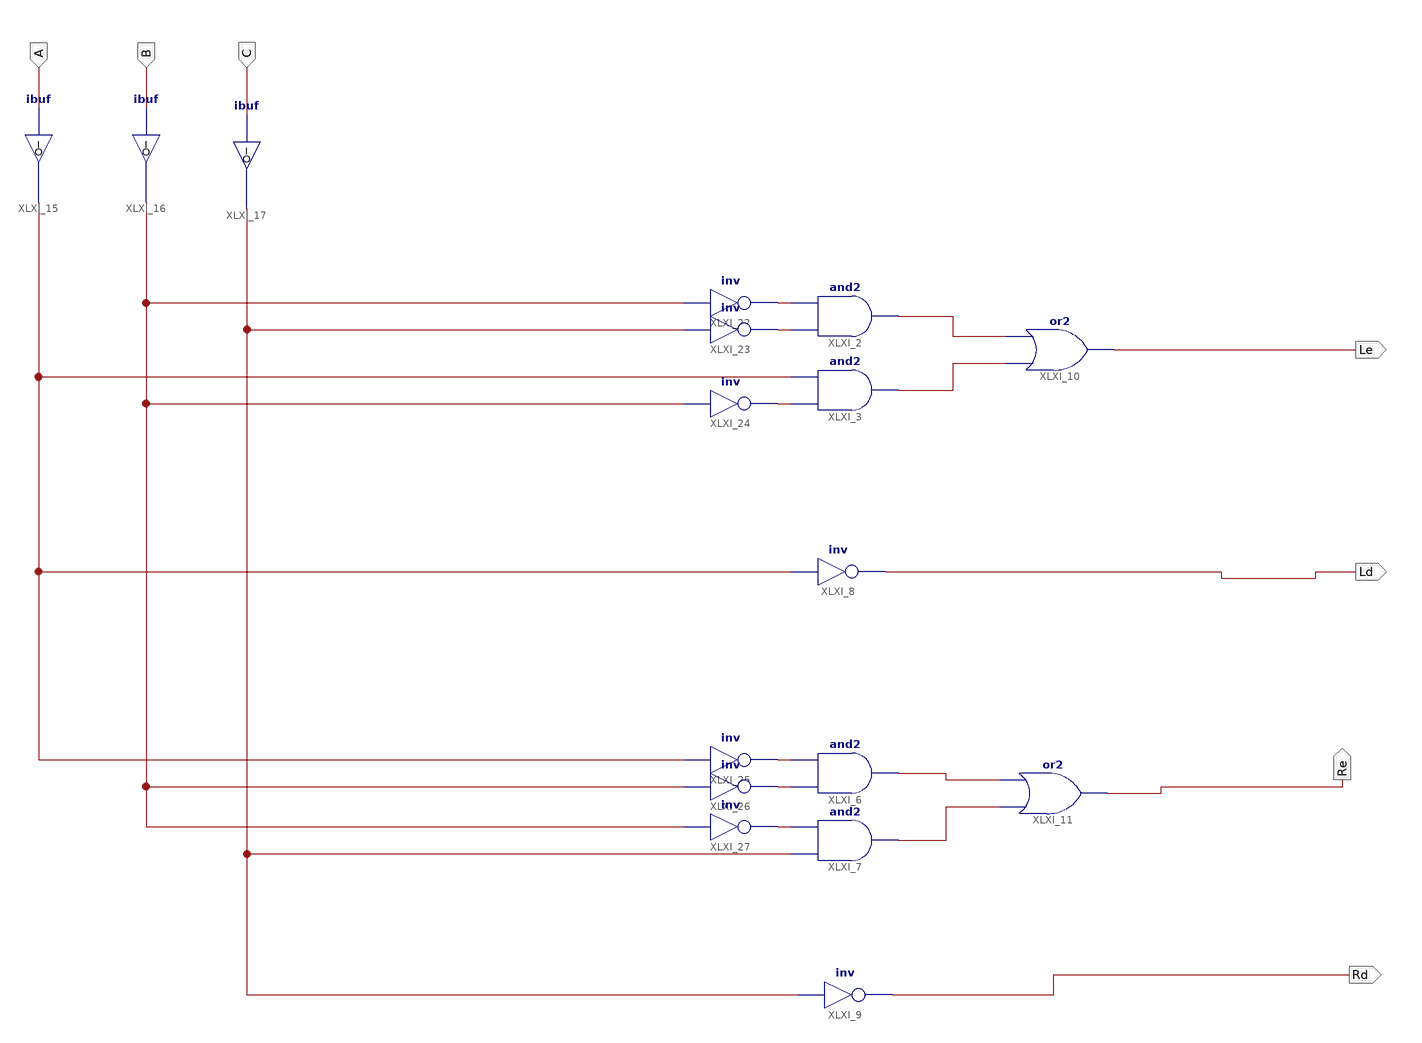
[diagram p0: schematic sheet 1]
// Xilinx ISE schematic Section3_Schematic.sch (xc9500xl) as structural Verilog: 17 symbols, 7 ports
module Section3_Schematic (
  input  A,
  input  B,
  input  C,
  output Le,
  output Ld,
  output Re,
  output Rd
);

  wire XLXN_3, XLXN_4, XLXN_7, XLXN_8, XLXN_11, XLXN_12, XLXN_13, XLXN_14, XLXN_15, XLXN_16, XLXN_17,
       XLXN_20, XLXN_24;

  and XLXI_2 (XLXN_3, XLXN_12, XLXN_11);
  and XLXI_3 (XLXN_4, XLXN_13, XLXN_17);
  and XLXI_6 (XLXN_7, XLXN_15, XLXN_14);
  and XLXI_7 (XLXN_8, XLXN_24, XLXN_16);
  not XLXI_8 (Ld, XLXN_17);
  not XLXI_9 (Rd, XLXN_24);
  or XLXI_10 (Le, XLXN_4, XLXN_3);
  or XLXI_11 (Re, XLXN_8, XLXN_7);
  ibuf XLXI_15 (.I(A), .O(XLXN_17));
  ibuf XLXI_16 (.I(B), .O(XLXN_20));
  ibuf XLXI_17 (.I(C), .O(XLXN_24));
  not XLXI_22 (XLXN_11, XLXN_20);
  not XLXI_23 (XLXN_12, XLXN_24);
  not XLXI_24 (XLXN_13, XLXN_20);
  not XLXI_25 (XLXN_14, XLXN_17);
  not XLXI_26 (XLXN_15, XLXN_20);
  not XLXI_27 (XLXN_16, XLXN_20);
endmodule
